# EAGLE design ssc_32u_power_board (EAGLE 7.7.0)

## Sheet 1 of 3
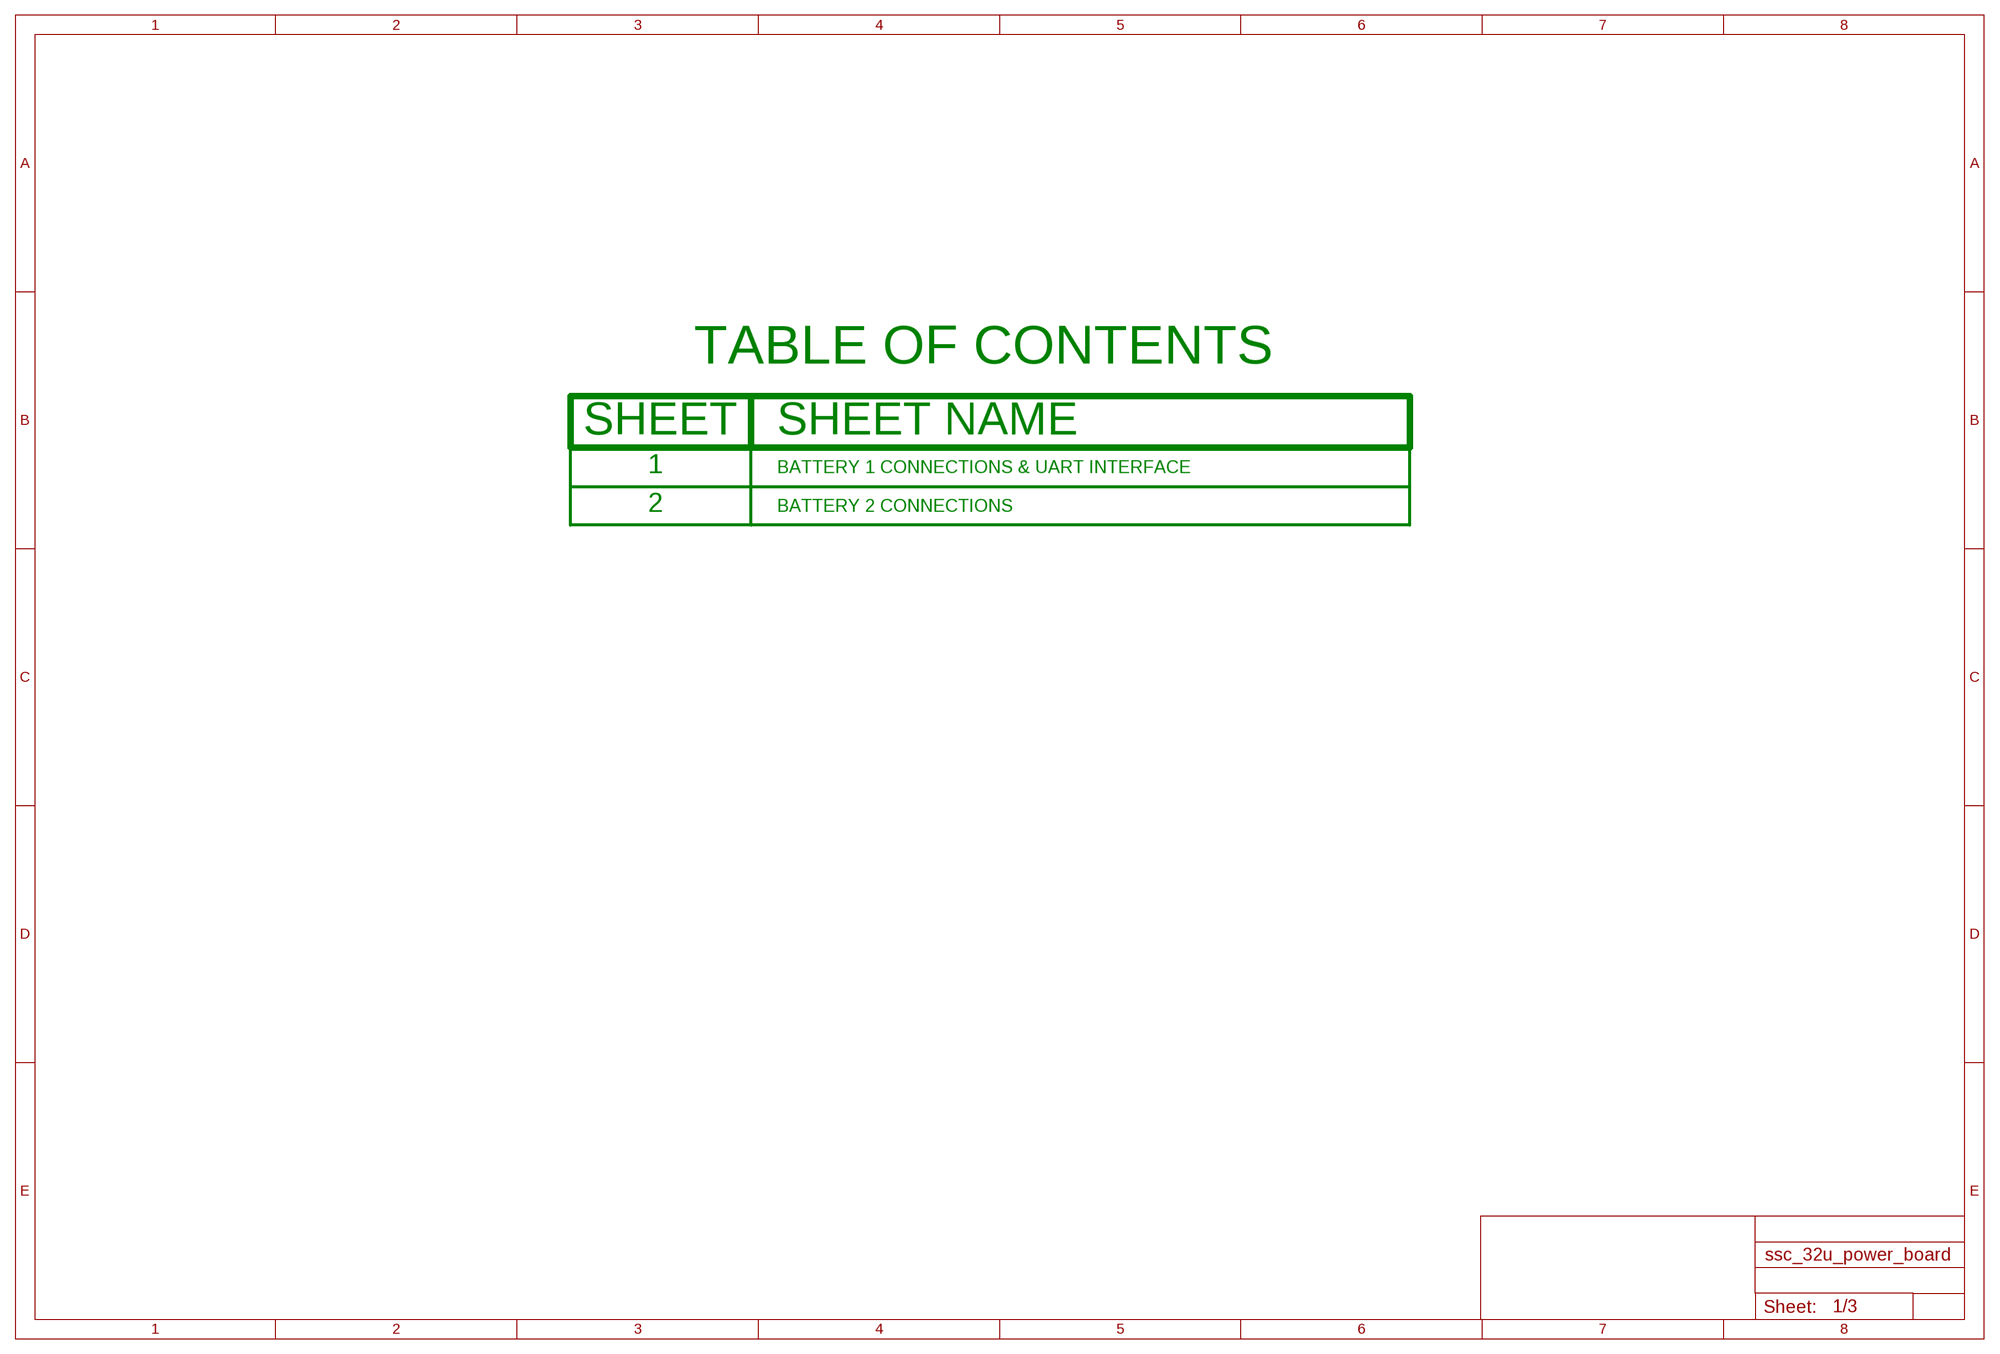
[diagram p0: schematic, sheet 1]

### Notes on the sheet
- BATTERY 1 CONNECTIONS & UART INTERFACE
- BATTERY 2 CONNECTIONS

## Sheet 2 of 3
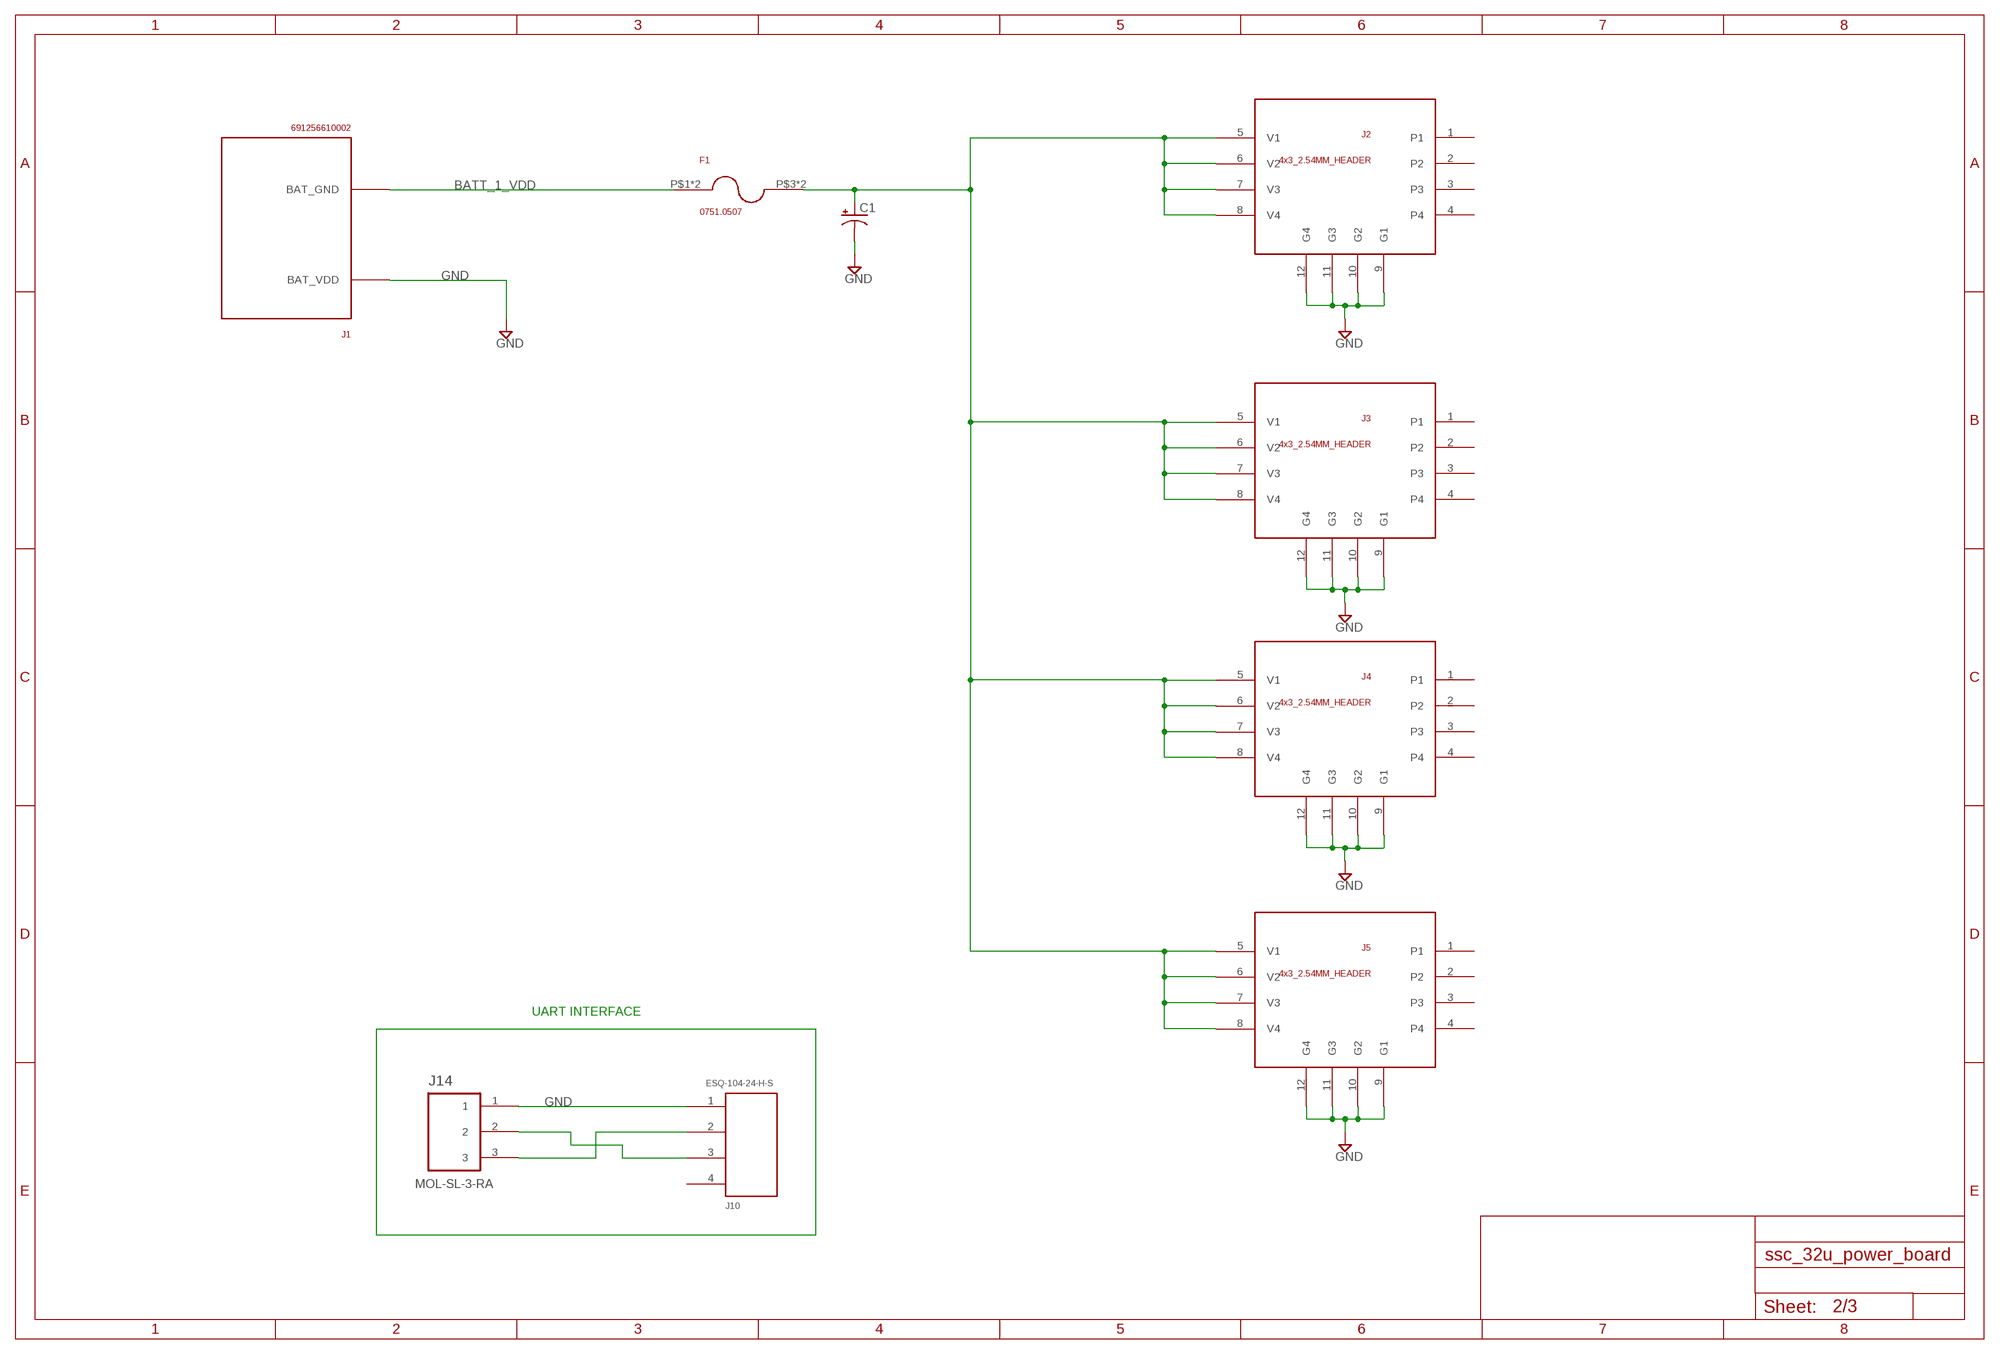
[diagram p1: schematic, sheet 2]

### Parts
C1  CPOL-USE5-13  [E5-13]
F1  0751.0507  [0751.0507]
J1  691256610002  [691256610002]
J2  4x3_2.54MM_HEADER  2X_ESQ-104-24-H-S__HMTSW-104-08-G-S-380  [2X_ESQ-104-24-H-S__HMTSW-104-08-G-S-380]
J3  4x3_2.54MM_HEADER  2X_ESQ-104-24-H-S__HMTSW-104-08-G-S-380  [2X_ESQ-104-24-H-S__HMTSW-104-08-G-S-380]
J4  4x3_2.54MM_HEADER  2X_ESQ-104-24-H-S__HMTSW-104-08-G-S-380  [2X_ESQ-104-24-H-S__HMTSW-104-08-G-S-380]
J5  4x3_2.54MM_HEADER  2X_ESQ-104-24-H-S__HMTSW-104-08-G-S-380  [2X_ESQ-104-24-H-S__HMTSW-104-08-G-S-380]
J10  ESQ-104-24-H-S  [ESQ-104-24-H-S]
J14  MOL-SL-3-RA  MOLSL_3PIN_SL3RA_RA  [MOLSL-3-RA]

### Nets
BATT_1_VDD: F1.P$1 F1.P$2 J1.P$1(BAT_GND) J1.P$2(BAT_GND)
BBB_TX_SSC_RX: J10.2 J14.3
BBB_TX_SSC_TX: J10.3 J14.2
GND: C1.- J1.P$3(BAT_VDD) J1.P$4(BAT_VDD) J2.9(G1) J2.10(G2) J2.11(G3) J2.12(G4) J3.9(G1) J3.10(G2) J3.11(G3) J3.12(G4) J4.9(G1) J4.10(G2) J4.11(G3) J4.12(G4) J5.9(G1) J5.10(G2) J5.11(G3) J5.12(G4) J10.1 J14.1 ; also sheet 3
VBAT_1_FUSE_0_15: C1.+ F1.P$3 F1.P$4 J2.5(V1) J2.6(V2) J2.7(V3) J2.8(V4) J3.5(V1) J3.6(V2) J3.7(V3) J3.8(V4) J4.5(V1) J4.6(V2) J4.7(V3) J4.8(V4) J5.5(V1) J5.6(V2) J5.7(V3) J5.8(V4)
Unconnected: J2.1 J2.2 J2.3 J2.4 J3.1 J3.2 J3.3 J3.4 J4.1 J4.2 J4.3 J4.4 J5.1 J5.2 J5.3 J5.4 J10.4

### Notes on the sheet
- UART INTERFACE

## Sheet 3 of 3
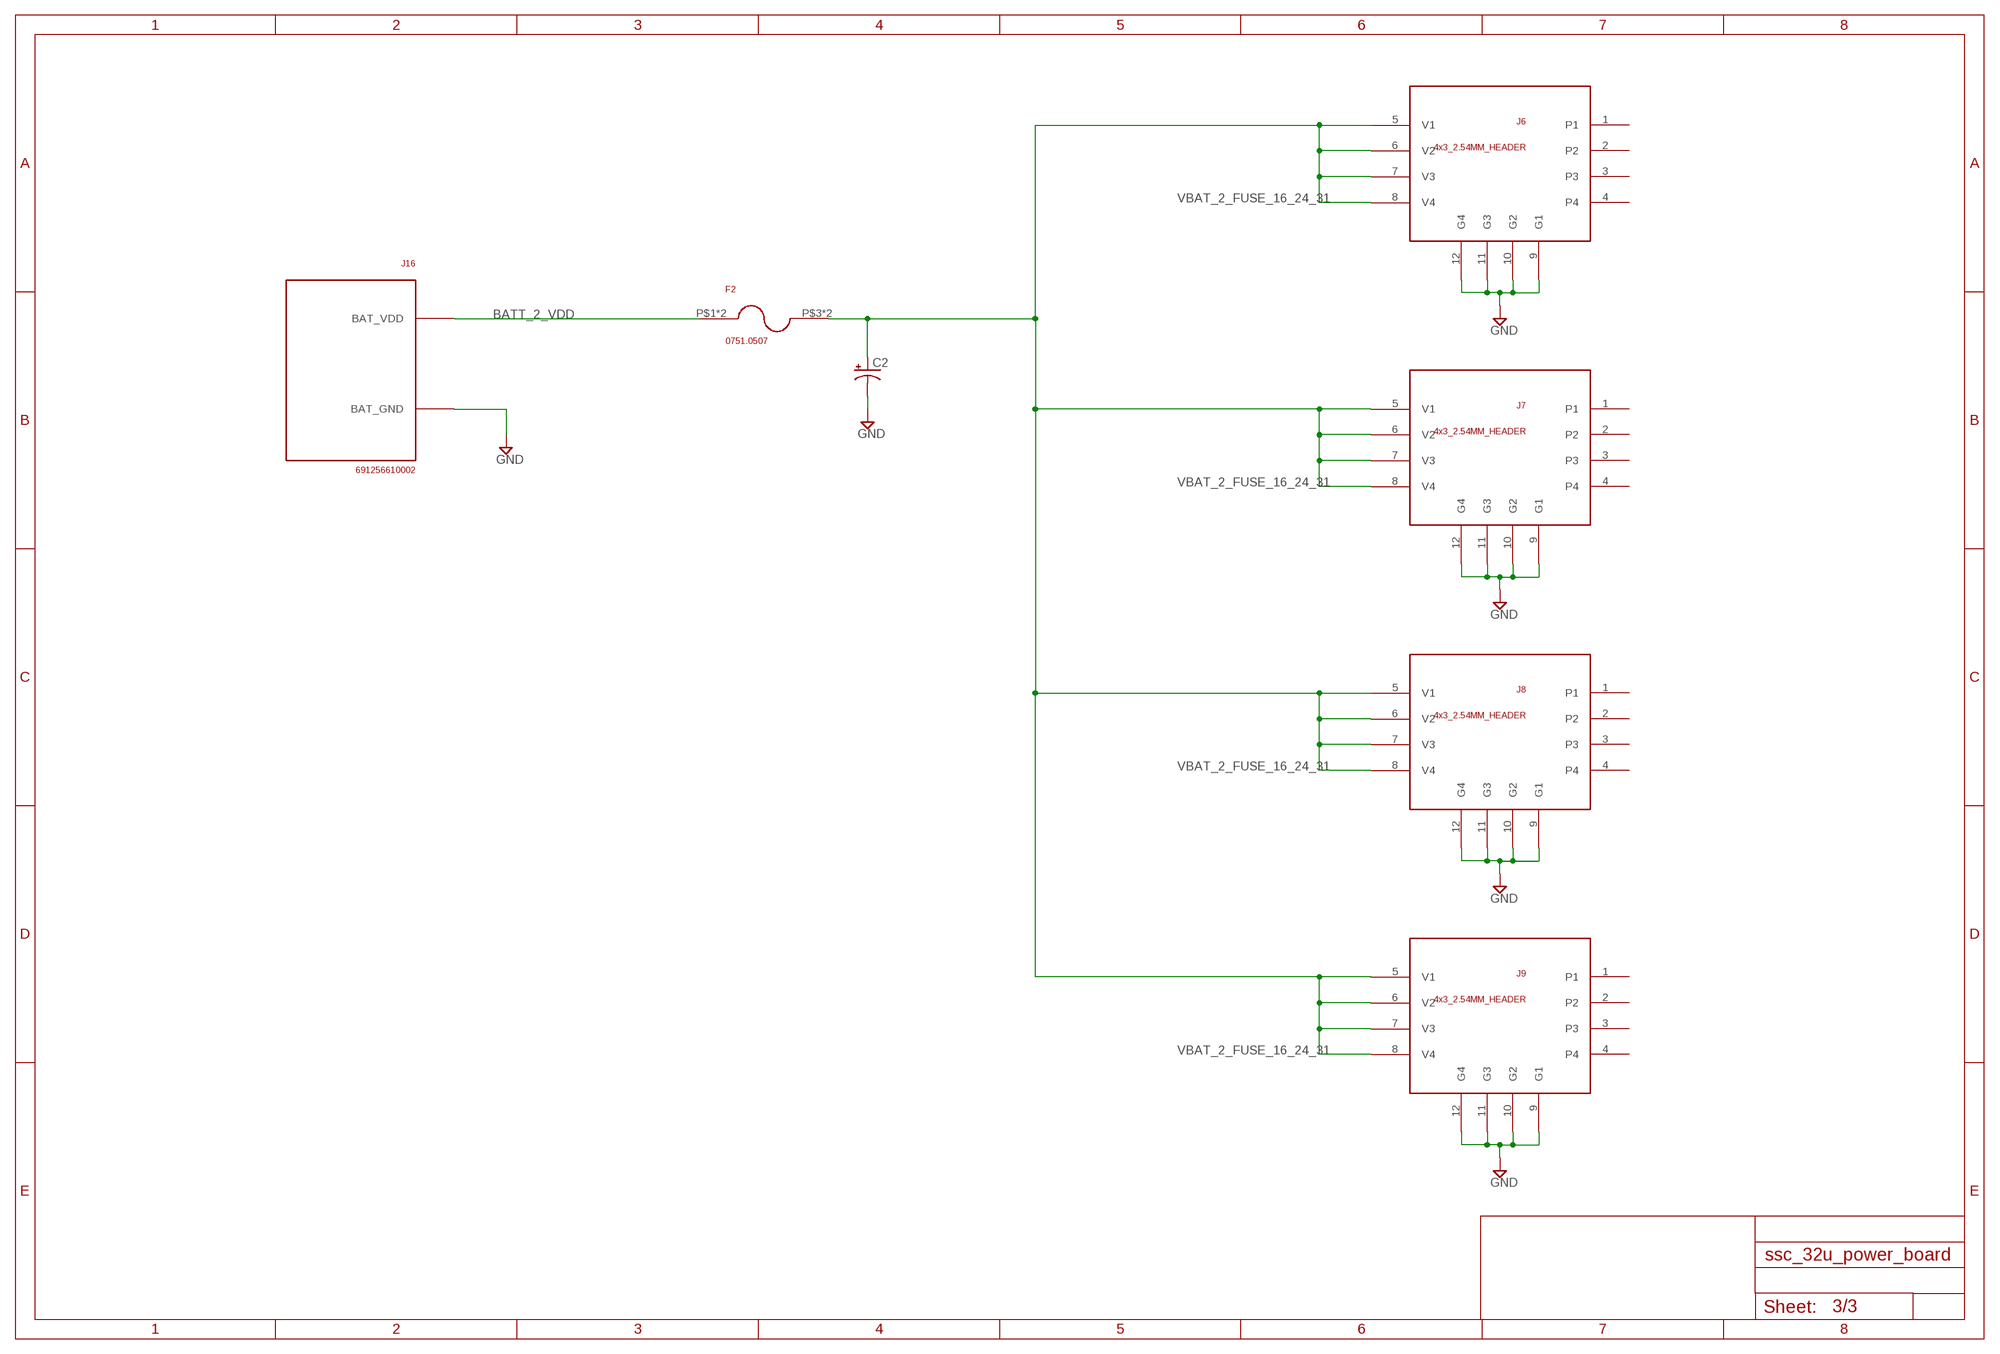
[diagram p2: schematic, sheet 3]

### Parts
C2  CPOL-USE5-13  [E5-13]
F2  0751.0507  [0751.0507]
J6  4x3_2.54MM_HEADER  2X_ESQ-104-24-H-S__HMTSW-104-08-G-S-380  [2X_ESQ-104-24-H-S__HMTSW-104-08-G-S-380]
J7  4x3_2.54MM_HEADER  2X_ESQ-104-24-H-S__HMTSW-104-08-G-S-380  [2X_ESQ-104-24-H-S__HMTSW-104-08-G-S-380]
J8  4x3_2.54MM_HEADER  2X_ESQ-104-24-H-S__HMTSW-104-08-G-S-380  [2X_ESQ-104-24-H-S__HMTSW-104-08-G-S-380]
J9  4x3_2.54MM_HEADER  2X_ESQ-104-24-H-S__HMTSW-104-08-G-S-380  [2X_ESQ-104-24-H-S__HMTSW-104-08-G-S-380]
J16  691256610002  [691256610002]

### Nets
BATT_2_VDD: F2.P$1 F2.P$2 J16.P$3(BAT_VDD) J16.P$4(BAT_VDD)
GND: C2.- J6.9(G1) J6.10(G2) J6.11(G3) J6.12(G4) J7.9(G1) J7.10(G2) J7.11(G3) J7.12(G4) J8.9(G1) J8.10(G2) J8.11(G3) J8.12(G4) J9.9(G1) J9.10(G2) J9.11(G3) J9.12(G4) J16.P$1(BAT_GND) J16.P$2(BAT_GND) ; also sheet 2
VBAT_2_FUSE_16_24_31: C2.+ F2.P$3 F2.P$4 J6.5(V1) J6.6(V2) J6.7(V3) J6.8(V4) J7.5(V1) J7.6(V2) J7.7(V3) J7.8(V4) J8.5(V1) J8.6(V2) J8.7(V3) J8.8(V4) J9.5(V1) J9.6(V2) J9.7(V3) J9.8(V4)
Unconnected: J6.1 J6.2 J6.3 J6.4 J7.1 J7.2 J7.3 J7.4 J8.1 J8.2 J8.3 J8.4 J9.1 J9.2 J9.3 J9.4

## Library data of the parts
C1 C2 = rcl:CPOL-US: POLARIZED CAPACITOR, American symbol
F1 F2 = ssc_32u_power_board:0751.0507; MANUFACTURER: Schurter Inc.; MANUFACTURER_PN: 0751.0507; VENDOR: Digi-key; VENDOR_PN: 486-3272-ND
J1 J16 = ssc_32u_power_board:691256610002; MANUFACTURER: Wurth Electronics Inc.; MANUFACTURER_PN: 691256610002; VENDOR: Digi-key; VENDOR_PN: 732-11031-ND
J2-J9 = ssc_32u_power_board:2X_ESQ-104-24-H-S__HMTSW-104-08-G-S-380
J10 = ssc_32u_power_board:ESQ-104-24-H-S; MANUFACTURER: Samtec; MANUFACTURER_PN: ESQ-104-24-H-S; VENDOR: Samtec; VENDOR_PN: ESQ-104-24-H-S
J14 = ssc_32u_power_board:MOLSL_3PIN: Molex SL Series 3-Position Connector Wire to board 2.54 mm (.1 inch) pitch header (right-angle or vertical) Housing: Vendor=Molex, Vendor_PN=0050579403 22-24 AWG Crimp: Vendor=Molex, Vendor_PN=0016020087 Wires: AWG,Amps (Max) 22, 3.0 24, 3.0 26, 1.8 28, 1.2; DATASHEET: HW/docs/projects/raspi_zero_power_sensor_hat/datasheets/connectors/uart_1wire_power_battery/705530001_sd.pdf; FINISH: GOLD; LOCKING: YES; MANUFACTURER: Molex; MANUFACTURER_PN: 0705530002; MAX_CURRENT: 3.0A; MOUNT_ANGLE: RIGHT; MOUNT_TYPE: TH; POSITIONS: 3; VENDOR: Digi-key; VENDOR_PN: WM4901-ND

## Board
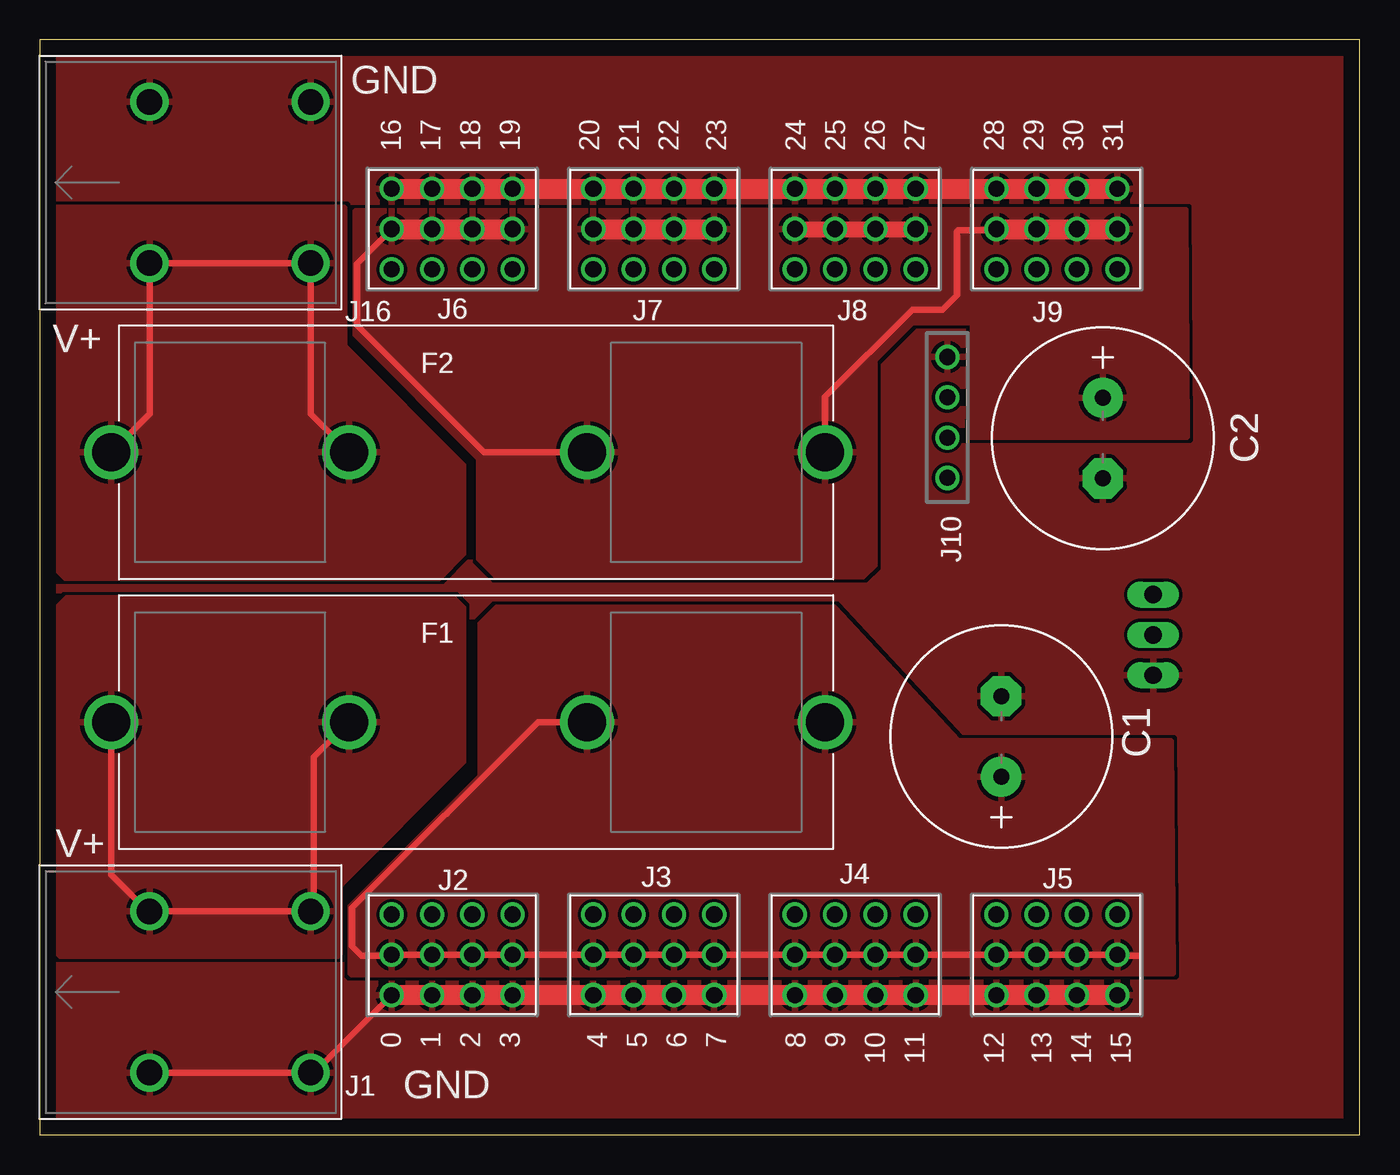
[diagram p3: board, top side]
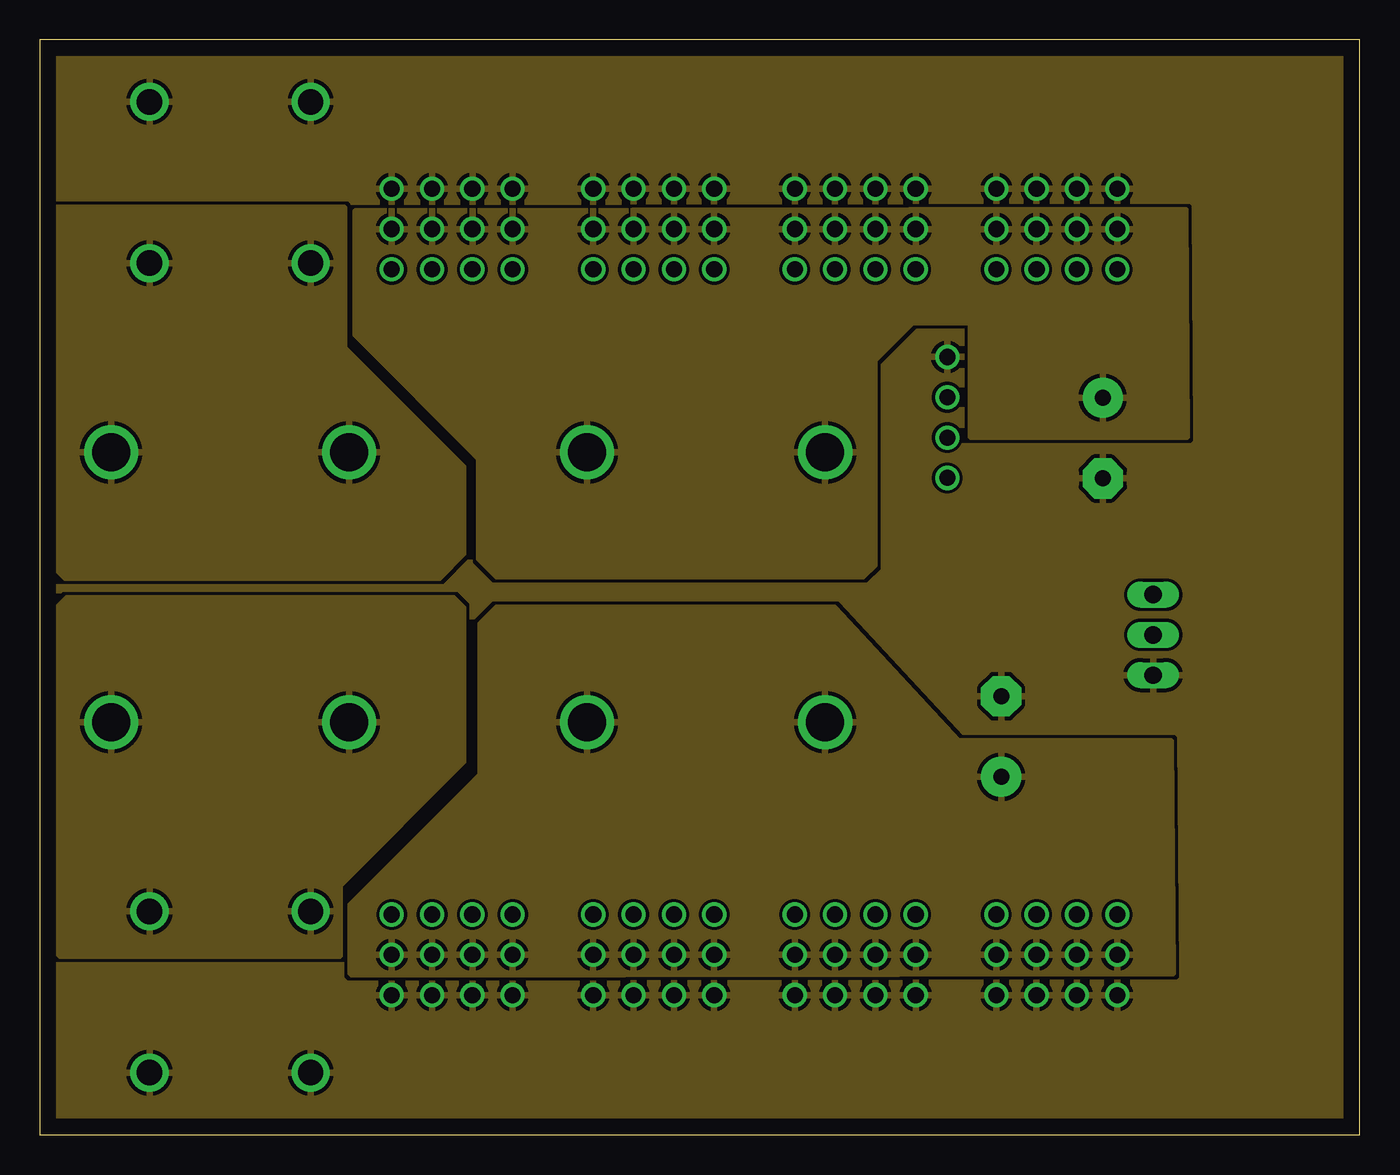
[diagram p4: board, inner layer Route2]
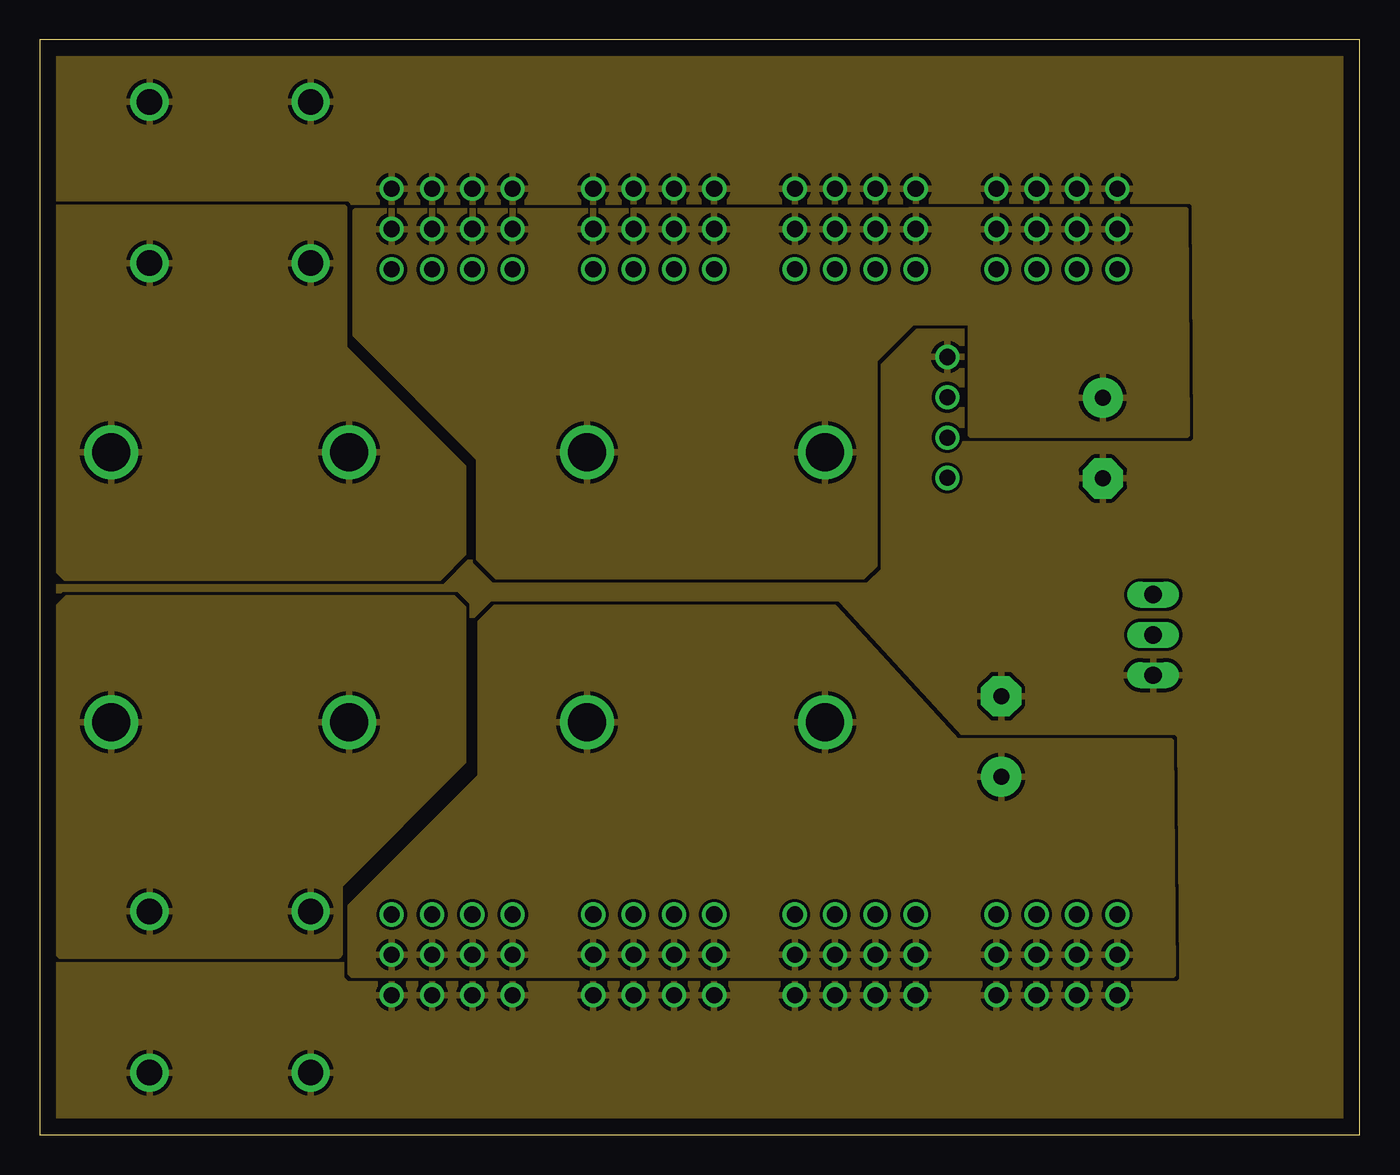
[diagram p5: board, inner layer Route15]
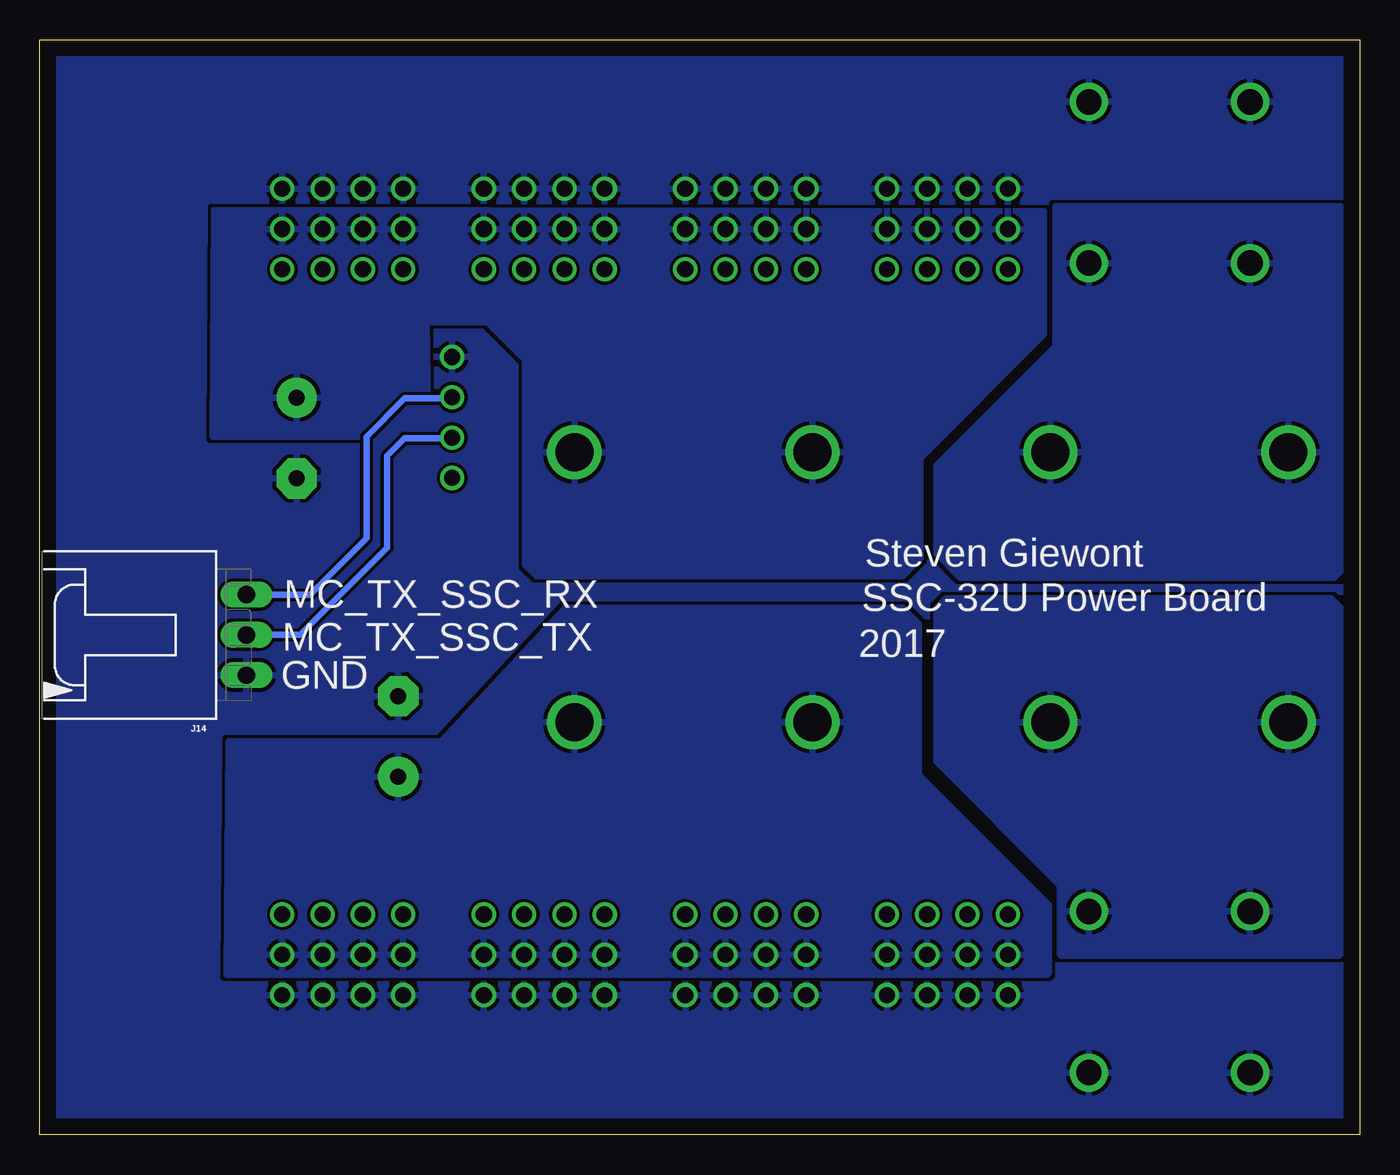
[diagram p6: board, bottom side, seen from below]

Size 83.2 x 69 mm. Coordinates in mm from the lower left corner, seen from the top.
Outline: 0,0 83.2,0 83.2,69 0,69 0,0
Copper layers (1+2*15+16): Top 0.035mm / dielectric 1.5mm / Route2 0.035mm / dielectric 0.15mm / Route15 0.035mm / dielectric 0.2mm / Bottom 0.035mm
Design rules "default *": minimum track width 10mil, minimum drill 24mil, track to track 8mil, track to pad 8mil, pad to pad 8mil, via to via 8mil, smd to smd 8mil, copper to edge 40mil, drill to drill 8mil, minimum pad ring 10mil, minimum via ring 8mil, stop-mask expansion 4mil, vias tented up to drill 0mil, thermal gap 10mil

### Footprints (pad centres in the part's own frame; a part is rotated, then mirrored left to right if it is on the bottom)
E5-13 = drill 1.016 pad 2.54: + -2.54,0 | drill 1.016 pad 2.54 octagon: - 2.54,0
0751.0507 = drill 2.4: P$1 -22.5,0; P$2 -7.5,0; P$3 7.5,0; P$4 22.5,0
691256610002 = drill 1.6: P$1 -5.08,5.08; P$2 -5.08,-5.08; P$3 5.08,5.08; P$4 5.08,-5.08
2X_ESQ-104-24-H-S__HMTSW-104-08-G-S-380 = drill 1.016 pad 1.524: 1 -3.81,2.54; 2 -1.27,2.54; 3 1.27,2.54; 4 3.81,2.54; 5 -3.81,0; 6 -1.27,0; 7 1.27,0; 8 3.81,0; 9 -3.81,-2.54; 10 -1.27,-2.54; 11 1.27,-2.54; 12 3.81,-2.54
ESQ-104-24-H-S = drill 1.016 pad 1.524: 1 -3.81,0; 2 -1.27,0; 3 1.27,0; 4 3.81,0
MOLSL-3-RA = drill 1.09 long: 1 -2.54,-7.62; 2 0,-7.62; 3 2.54,-7.62

### Placement (x,y rotation side)
C1  60.6,25.1 90 top
C2  67,43.9 270 top
F1  27,26 0 top
F2  27,43 0 top
J1  12,9 270 top
J2  26,11.35 0 top
J3  38.7,11.35 0 top
J4  51.4,11.35 0 top
J5  64.1,11.35 0 top
J6  26,57.07 180 top
J7  38.7,57.07 180 top
J8  51.4,57.07 180 top
J9  64.1,57.07 180 top
J10  57.2,45.2 270 top
J14  77.8,31.5 90 bottom
J16  12,60 270 top

### Tracks (layer width: path | path; a pad name or v marks a point on that pad's centre or on a via)
BATT_1_VDD
  Top 0.406: F1.P$1 4.5,16.4 6.82,14.08 J1.P$2 J1.P$1 17.28,14.08 17.28,23.78 F1.P$2 19.6,25.9
  pour Top: 18.8,11.3 1.3,11.3 0.7,11.9 0.7,32.8 1.7,33.8 26.1,33.8 26.7,33.2 26.7,23.5 18.9,15.7 18.9,11.4
  pour Bottom: 1.8,33.8 26.1,33.8 26.7,33.2 26.7,23.5 18.9,15.7 18.9,11.4 18.8,11.3 1.3,11.3 0.7,11.9 0.7,32.7
  pour Route2: 1.3,11.3 18.9,11.3 18.9,15.7 26.7,23.5 26.7,33.2 26.1,33.8 1.7,33.8 0.7,32.8 0.7,11.9
  pour Route15: 2.3,11.3 18.8,11.3 18.9,11.4 18.9,15.7 26.7,23.5 26.7,33.2 26.1,33.8 1.7,33.8 0.7,32.8 0.7,11.9 1.3,11.3
BATT_2_VDD
  Top 0.406: F2.P$1 6.92,45.42 J16.P$4 J16.P$3 17.08,45.42 F2.P$2
  pour Top: 1.1,58.4 19.2,58.4 19.2,49.6 19.3,49.6 26.7,42.2 26.7,36.6 25.2,35.1 1.6,35.1 0.6,36.1 0.6,57.9
  pour Bottom: 1.2,58.5 19.2,58.5 19.2,49.7 26.7,42.2 26.7,36.6 25.2,35.1 1.6,35.1 0.6,36.1 0.6,57.9
  pour Route2: 1.8,35.1 25.2,35.1 26.7,36.6 26.7,42.1 19.2,49.6 19.2,58.4 1.1,58.4 0.6,57.9 0.6,36.1 1.6,35.1 1.7,35.1
  pour Route15: 2.6,35.1 25.2,35.1 26.7,36.6 26.7,42.1 19.2,49.6 19.2,58.4 1.1,58.4 0.6,57.9 0.6,36.1 1.6,35.1
BBB_TX_SSC_RX
  Bottom 0.406: J14.3 66.16,34.04 62.6,37.6 62.6,44 60.2,46.4 57.27,46.4 J10.2
BBB_TX_SSC_TX
  Bottom 0.406: J14.2 66.8,31.5 61.3,37 61.3,42.8 60.2,43.9 57.23,43.9 J10.3
GND
  Top 0.406: J1.P$4 J1.P$3 17.3,3.92 J2.9
  Top 1.27: J6.12 J6.11 J6.10 J6.9 J7.12 J7.11 J7.10 J7.9 J8.12 J8.11 J8.10 J8.9 J9.12 J9.11 J9.10 J9.9 | J5.12 J5.11 J5.10 J5.9 J4.12 J4.11 J4.10 J4.9 J3.12 J3.11 J3.10 J3.9 J2.12 J2.11 J2.10 J2.9
  pour Top (rank 2): 0,-1.1 84,-1.1 83.7,69.3 -0.3,69.3
  pour Bottom (rank 2): -0.4,69.3 84.1,69.4 84.5,-0.9 0,-1
  pour Route15 (rank 2): -0.2,-1 84.5,-1 84.5,69.6 -0.2,69.6
  pour Route2 (rank 2): -0.2,-1 84.5,-1 84.5,69.6 -0.2,69.6
VBAT_1_FUSE_0_15
  Top 0.406: F1.P$3 31.4,26 19.7,14.3 19.7,11.9 20.3,11.3 22.14,11.3 | J2.5 J2.6 J2.7 J2.8 J3.5 J3.6 J3.7 J3.8 J4.5 J4.6 J4.7 J4.8 J5.5 J5.6 J5.7 J5.8 67.96,11.3 69.3,11.3
  pour Top: 19.7,10.1 71.4,10.2 71.3,24.8 57.9,24.8 50.1,33.2 28.8,33.2 27.8,32.2 27.8,22.6 19.6,14.4 19.6,10.2
  pour Bottom: 28.8,33.2 50.1,33.2 57.9,24.8 71.3,24.8 71.4,10.1 19.7,10.1 19.6,10.2 19.6,14.5 27.8,22.7 27.8,32.2
  pour Route2: 19.7,10.1 71.4,10.2 71.3,24.8 57.9,24.8 50.1,33.2 28.8,33.2 27.8,32.2 27.8,22.7 19.6,14.5 19.6,10.2
  pour Route15: 19.7,10.1 71.4,10.1 71.3,24.8 57.8,24.8 50.1,33.2 28.7,33.2 27.8,32.3 27.8,22.6 19.6,14.4 19.6,10.2
VBAT_2_FUSE_16_24_31
  Top 0.406: F2.P$3 28,43 20,51 20,54.88 J6.8 | F2.P$4 49.5,46.5 55,52 56.9,52 57.8,52.9 57.8,56.9 57.9,57 60.22,57 J9.8
  Top 1: J8.8 J8.7 J8.6 J8.5
  Top 1.27: J6.8 J6.7 J6.6 J6.5 | J9.8 J9.7 J9.6 J9.5 | J7.8 J7.7 J7.6 J7.5
  pour Top: 19.9,58.2 72.2,58.3 72.3,44 58.7,44 58.8,51.2 55,51.2 52.6,48.8 52.6,35.9 51.9,35.2 28.8,35.2 27.7,36.3 27.7,42.6 19.9,50.4
  pour Bottom: 19.9,58.2 72.2,58.3 72.3,44 58.7,44 58.8,51.2 55,51.2 52.6,48.8 52.6,35.9 51.9,35.2 28.8,35.2 27.7,36.3 27.7,42.6 19.9,50.4
  pour Route2: 28.8,35.2 51.9,35.2 52.6,35.9 52.6,48.8 55,51.2 58.7,51.2 58.7,44 72.3,44 72.2,58.3 19.9,58.2 19.9,50.4 27.7,42.6 27.7,36.3
  pour Route15: 28.8,35.2 51.9,35.2 52.6,35.9 52.6,48.8 55,51.2 58.7,51.2 58.7,44.1 72.3,44.1 72.2,58.3 19.9,58.2 19.9,50.4 27.7,42.6 27.7,36.3

### Text on the board
tPlace: GND | 16 | 17 | 18 | 19 | 20 | 21 | 22 | 23 | 24 | 25 | 26 | 27 | 28 | 29 | 30 | 31 | V+ | V+ | 0 | 1 | 2 | 3 | 4 | 5 | 6 | 7 | 8 | 9 | 10 | 11 | 12 | 13 | 14 | 15 | GND
bPlace: Steven Giewont | SSC-32U Power Board | MC_TX_SSC_RX | 2017 | MC_TX_SSC_TX | GND
_tPlace: J16 | F2 | F1 | J1
_tNames: J6 | J7 | J8 | J9 | C2 | J10 | C1 | J3 | J4 | J5 | J2
_bNames: J14